# EAGLE design 2023-06-29 LVMi Thermistors (EAGLE 9.6.2)

## Sheet 1 of 4
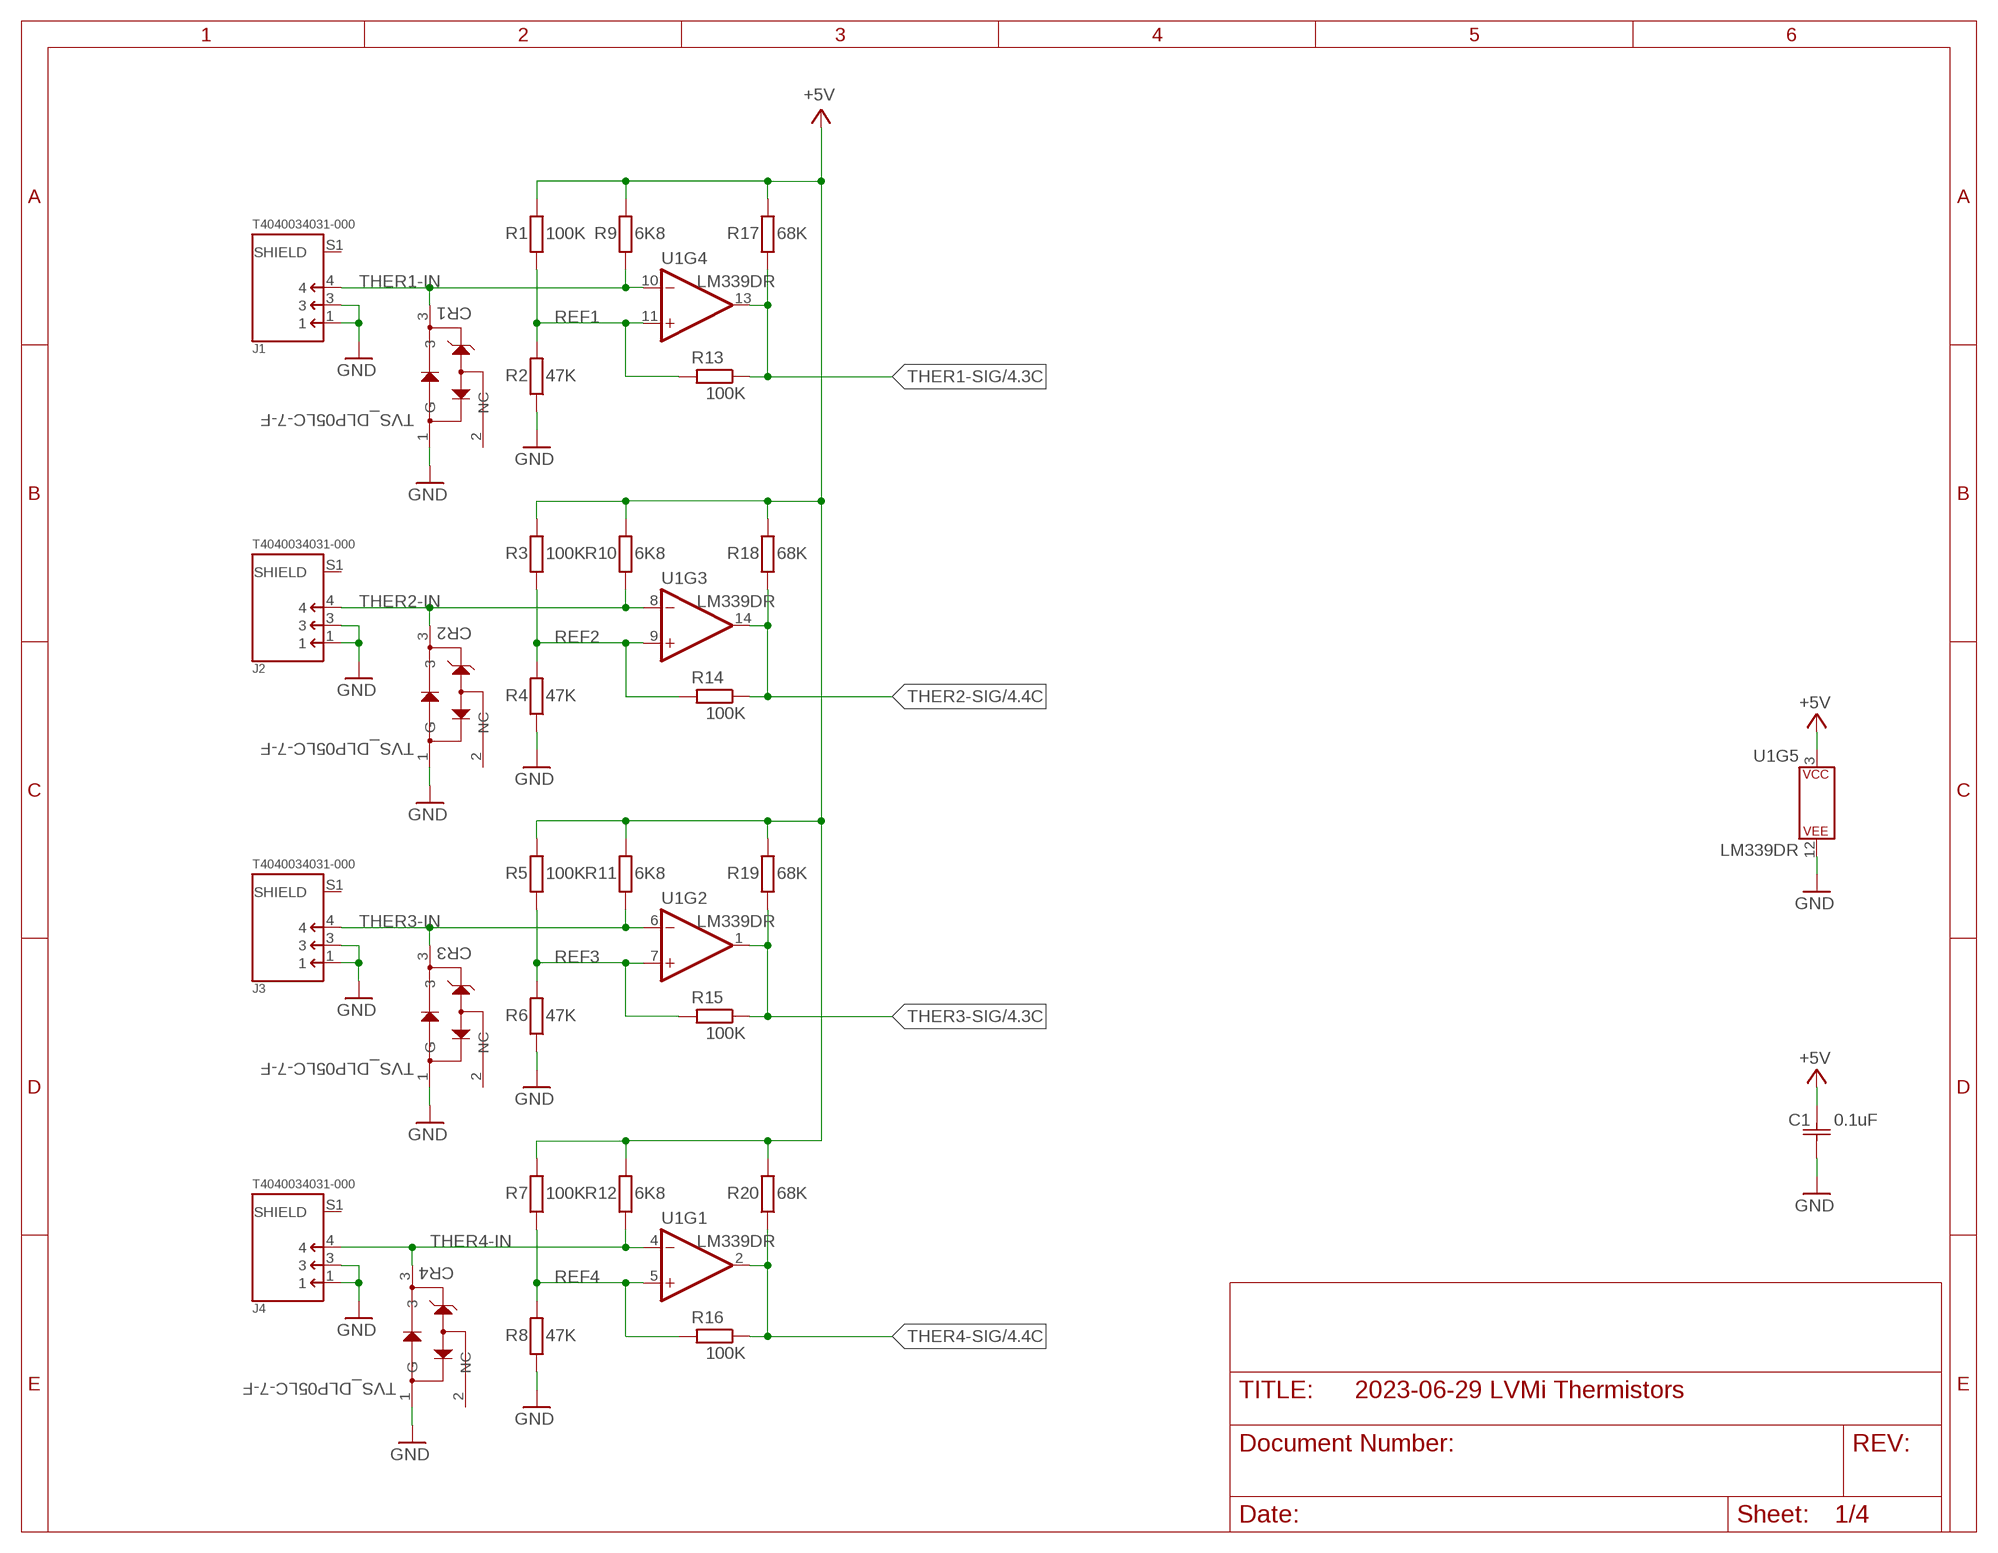
[diagram p0: schematic, sheet 1]

### Parts
C1  0.1uF  CAPTHRUHOLE  [K104K15X7RF5TL2_VIS]
CR1  TVS_DLP05LC-7-F  [SOT23_DLP05LC_DIO]
CR2  TVS_DLP05LC-7-F  [SOT23_DLP05LC_DIO]
CR3  TVS_DLP05LC-7-F  [SOT23_DLP05LC_DIO]
CR4  TVS_DLP05LC-7-F  [SOT23_DLP05LC_DIO]
J1  T4040034031-000  [TE_T4040034031-000]
J2  T4040034031-000  [TE_T4040034031-000]
J3  T4040034031-000  [TE_T4040034031-000]
J4  T4040034031-000  [TE_T4040034031-000]
R1  100K  R-EU_0207/10  [0207/10]
R2  47K  R-EU_0207/10  [0207/10]
R3  100K  R-EU_0207/10  [0207/10]
R4  47K  R-EU_0207/10  [0207/10]
R5  100K  R-EU_0207/10  [0207/10]
R6  47K  R-EU_0207/10  [0207/10]
R7  100K  R-EU_0207/10  [0207/10]
R8  47K  R-EU_0207/10  [0207/10]
R9  6K8  R-EU_0207/10  [0207/10]
R10  6K8  R-EU_0207/10  [0207/10]
R11  6K8  R-EU_0207/10  [0207/10]
R12  6K8  R-EU_0207/10  [0207/10]
R13  100K  R-EU_0207/10  [0207/10]
R14  100K  R-EU_0207/10  [0207/10]
R15  100K  R-EU_0207/10  [0207/10]
R16  100K  R-EU_0207/10  [0207/10]
R17  68K  R-EU_0207/10  [0207/10]
R18  68K  R-EU_0207/10  [0207/10]
R19  68K  R-EU_0207/10  [0207/10]
R20  68K  R-EU_0207/10  [0207/10]
U1  LM339DR  LM339SOIC-14  [SOIC127P599X175-14]

### Nets
+5V: C1.2 R1.2 R3.2 R5.2 R7.2 R9.2 R10.2 R11.2 R12.2 R17.2 R18.2 R19.2 R20.2 U1.3(P$V+) ; also sheet 2,3,4
GND: C1.1 CR1.1(G) CR2.1(G) CR3.1(G) CR4.1(G) J1.1 J1.3 J2.1 J2.3 J3.1 J3.3 J4.1 J4.3 R2.1 R4.1 R6.1 R8.1 U1.12(P$V-) ; also sheet 2,3,4
REF1: R1.1 R2.2 R13.2 U1.11(+IN)
REF2: R3.1 R4.2 R14.2 U1.9(+IN)
REF3: R5.1 R6.2 R15.2 U1.7(+IN)
REF4: R7.1 R8.2 R16.2 U1.5(+IN)
THER1-IN: CR1.3 J1.4 R9.1 U1.10(-IN)
THER1-SIG: R13.1 R17.1 U1.13(OUT) ; also sheet 4
THER2-IN: CR2.3 J2.4 R10.1 U1.8(-IN)
THER2-SIG: R14.1 R18.1 U1.14(OUT) ; also sheet 4
THER3-IN: CR3.3 J3.4 R11.1 U1.6(-IN)
THER3-SIG: R15.1 R19.1 U1.1(OUT) ; also sheet 4
THER4-IN: CR4.3 J4.4 R12.1 U1.4(-IN)
THER4-SIG: R16.1 R20.1 U1.2(OUT) ; also sheet 4
Unconnected: CR1.2(NC) CR2.2(NC) CR3.2(NC) CR4.2(NC) J1.S1(SHIELD) J2.S1(SHIELD) J3.S1(SHIELD) J4.S1(SHIELD)

### Notes on the sheet
- Thermistor Connectors and Comparators

## Sheet 2 of 4
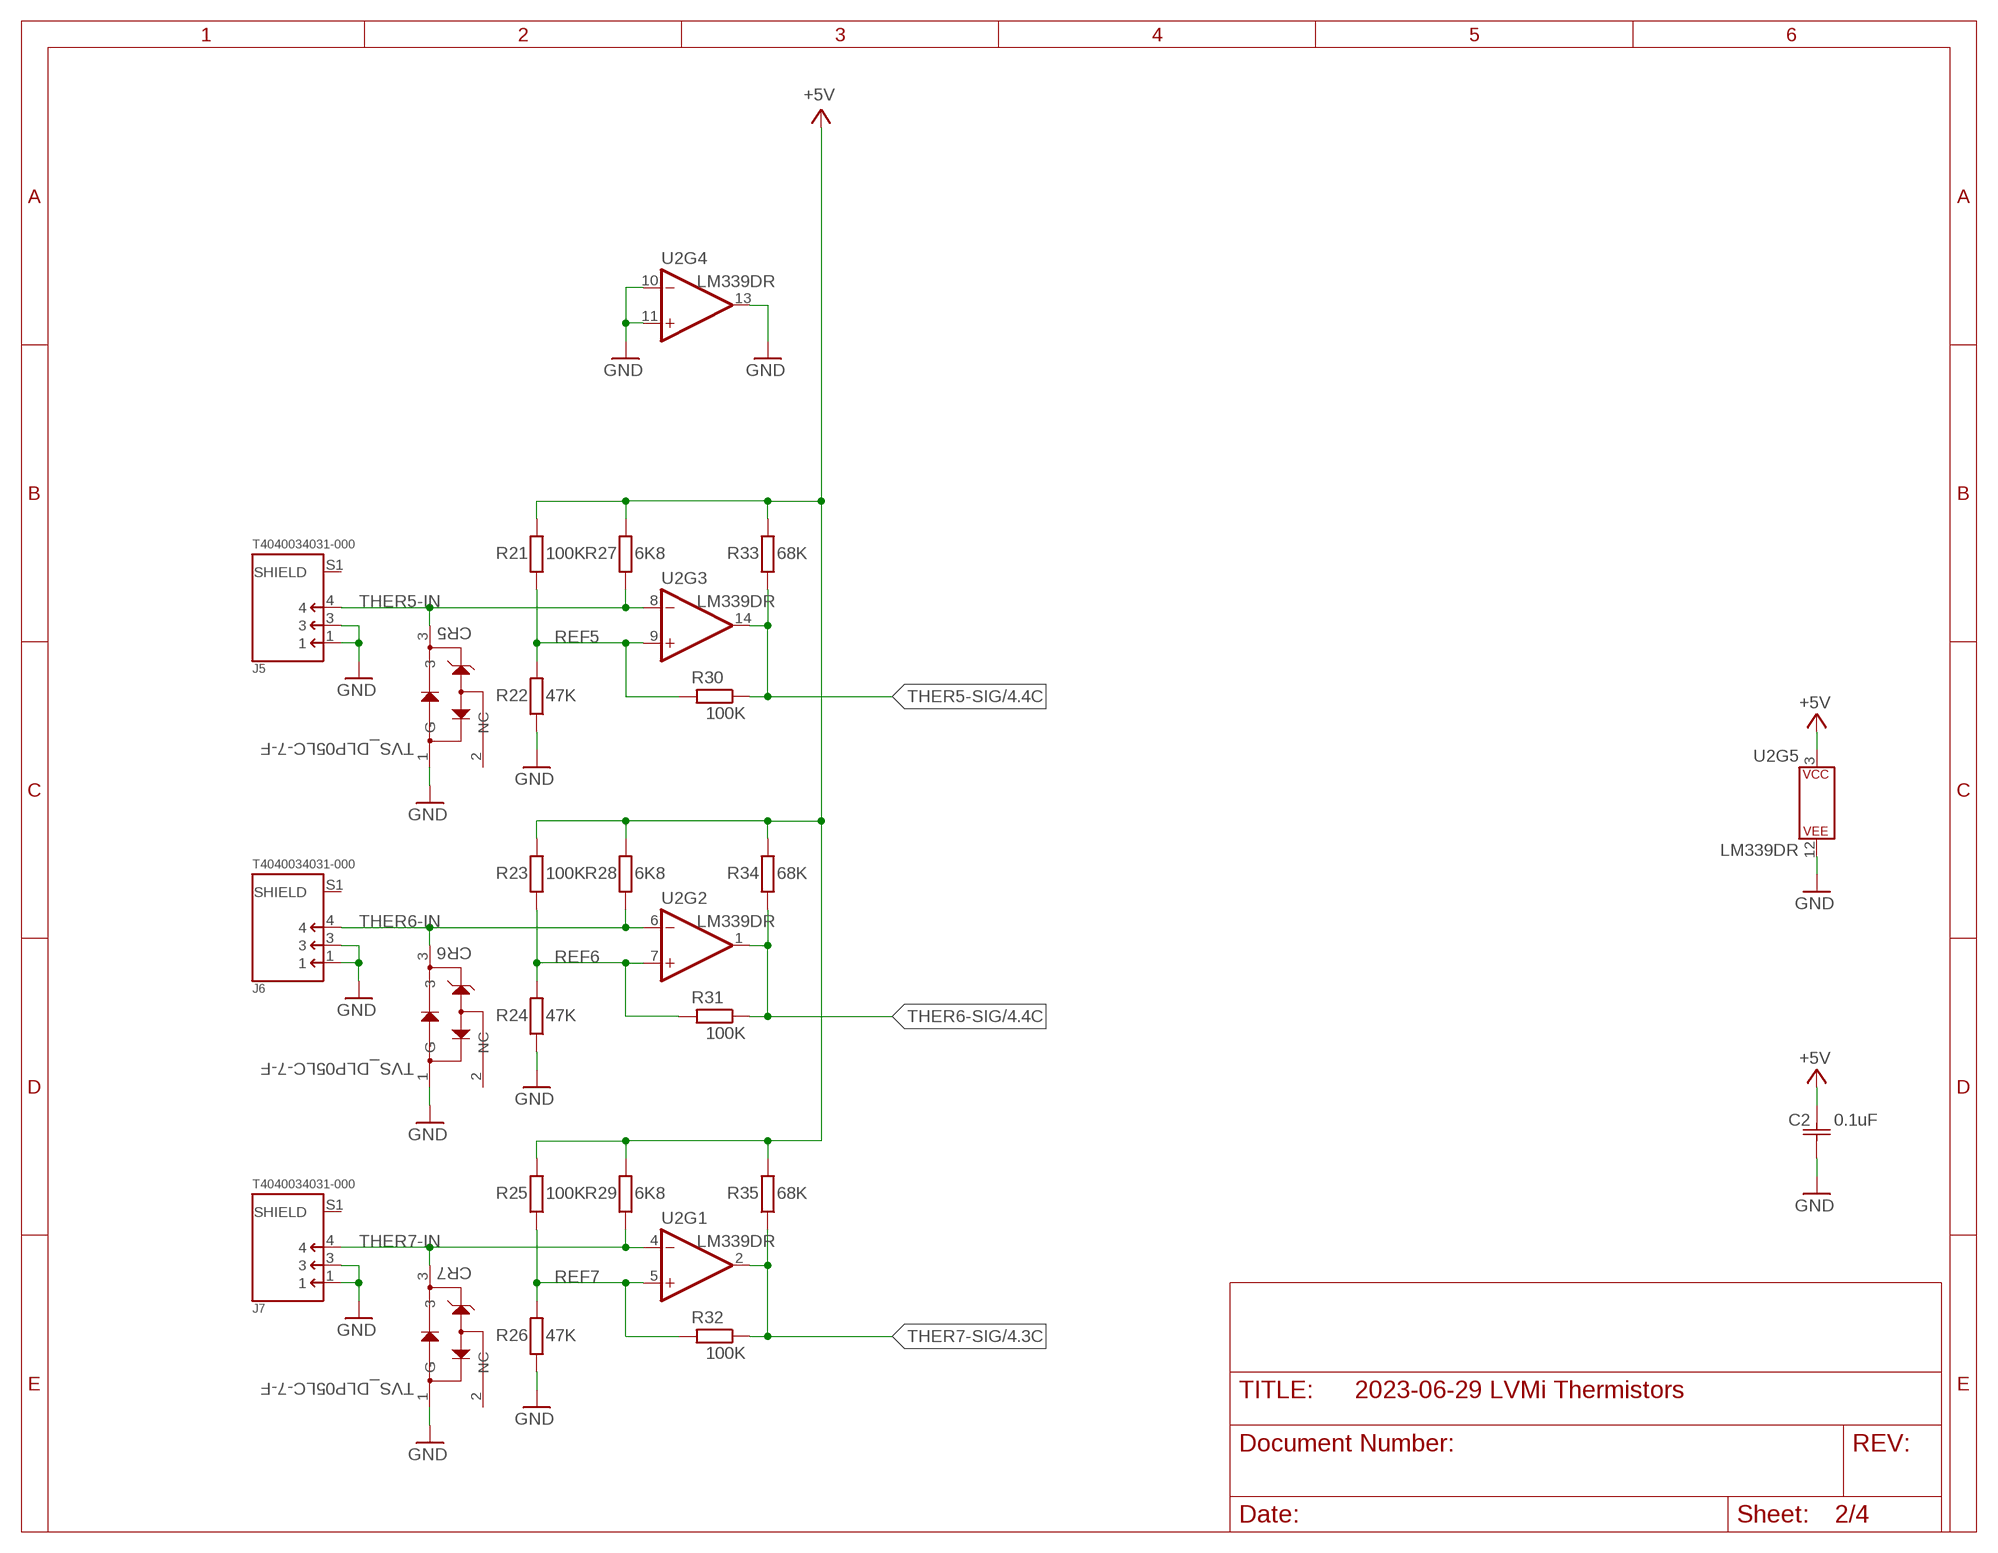
[diagram p1: schematic, sheet 2]

### Parts
C2  0.1uF  CAPTHRUHOLE  [K104K15X7RF5TL2_VIS]
CR5  TVS_DLP05LC-7-F  [SOT23_DLP05LC_DIO]
CR6  TVS_DLP05LC-7-F  [SOT23_DLP05LC_DIO]
CR7  TVS_DLP05LC-7-F  [SOT23_DLP05LC_DIO]
J5  T4040034031-000  [TE_T4040034031-000]
J6  T4040034031-000  [TE_T4040034031-000]
J7  T4040034031-000  [TE_T4040034031-000]
R21  100K  R-EU_0207/10  [0207/10]
R22  47K  R-EU_0207/10  [0207/10]
R23  100K  R-EU_0207/10  [0207/10]
R24  47K  R-EU_0207/10  [0207/10]
R25  100K  R-EU_0207/10  [0207/10]
R26  47K  R-EU_0207/10  [0207/10]
R27  6K8  R-EU_0207/10  [0207/10]
R28  6K8  R-EU_0207/10  [0207/10]
R29  6K8  R-EU_0207/10  [0207/10]
R30  100K  R-EU_0207/10  [0207/10]
R31  100K  R-EU_0207/10  [0207/10]
R32  100K  R-EU_0207/10  [0207/10]
R33  68K  R-EU_0207/10  [0207/10]
R34  68K  R-EU_0207/10  [0207/10]
R35  68K  R-EU_0207/10  [0207/10]
U2  LM339DR  LM339SOIC-14  [SOIC127P599X175-14]

### Nets
+5V: C2.2 R21.2 R23.2 R25.2 R27.2 R28.2 R29.2 R33.2 R34.2 R35.2 U2.3(P$V+) ; also sheet 1,3,4
GND: C2.1 CR5.1(G) CR6.1(G) CR7.1(G) J5.1 J5.3 J6.1 J6.3 J7.1 J7.3 R22.1 R24.1 R26.1 U2.10(-IN) U2.11(+IN) U2.12(P$V-) U2.13(OUT) ; also sheet 1,3,4
REF5: R21.1 R22.2 R30.2 U2.9(+IN)
REF6: R23.1 R24.2 R31.2 U2.7(+IN)
REF7: R25.1 R26.2 R32.2 U2.5(+IN)
THER5-IN: CR5.3 J5.4 R27.1 U2.8(-IN)
THER5-SIG: R30.1 R33.1 U2.14(OUT) ; also sheet 4
THER6-IN: CR6.3 J6.4 R28.1 U2.6(-IN)
THER6-SIG: R31.1 R34.1 U2.1(OUT) ; also sheet 4
THER7-IN: CR7.3 J7.4 R29.1 U2.4(-IN)
THER7-SIG: R32.1 R35.1 U2.2(OUT) ; also sheet 4
Unconnected: CR5.2(NC) CR6.2(NC) CR7.2(NC) J5.S1(SHIELD) J6.S1(SHIELD) J7.S1(SHIELD)

## Sheet 3 of 4
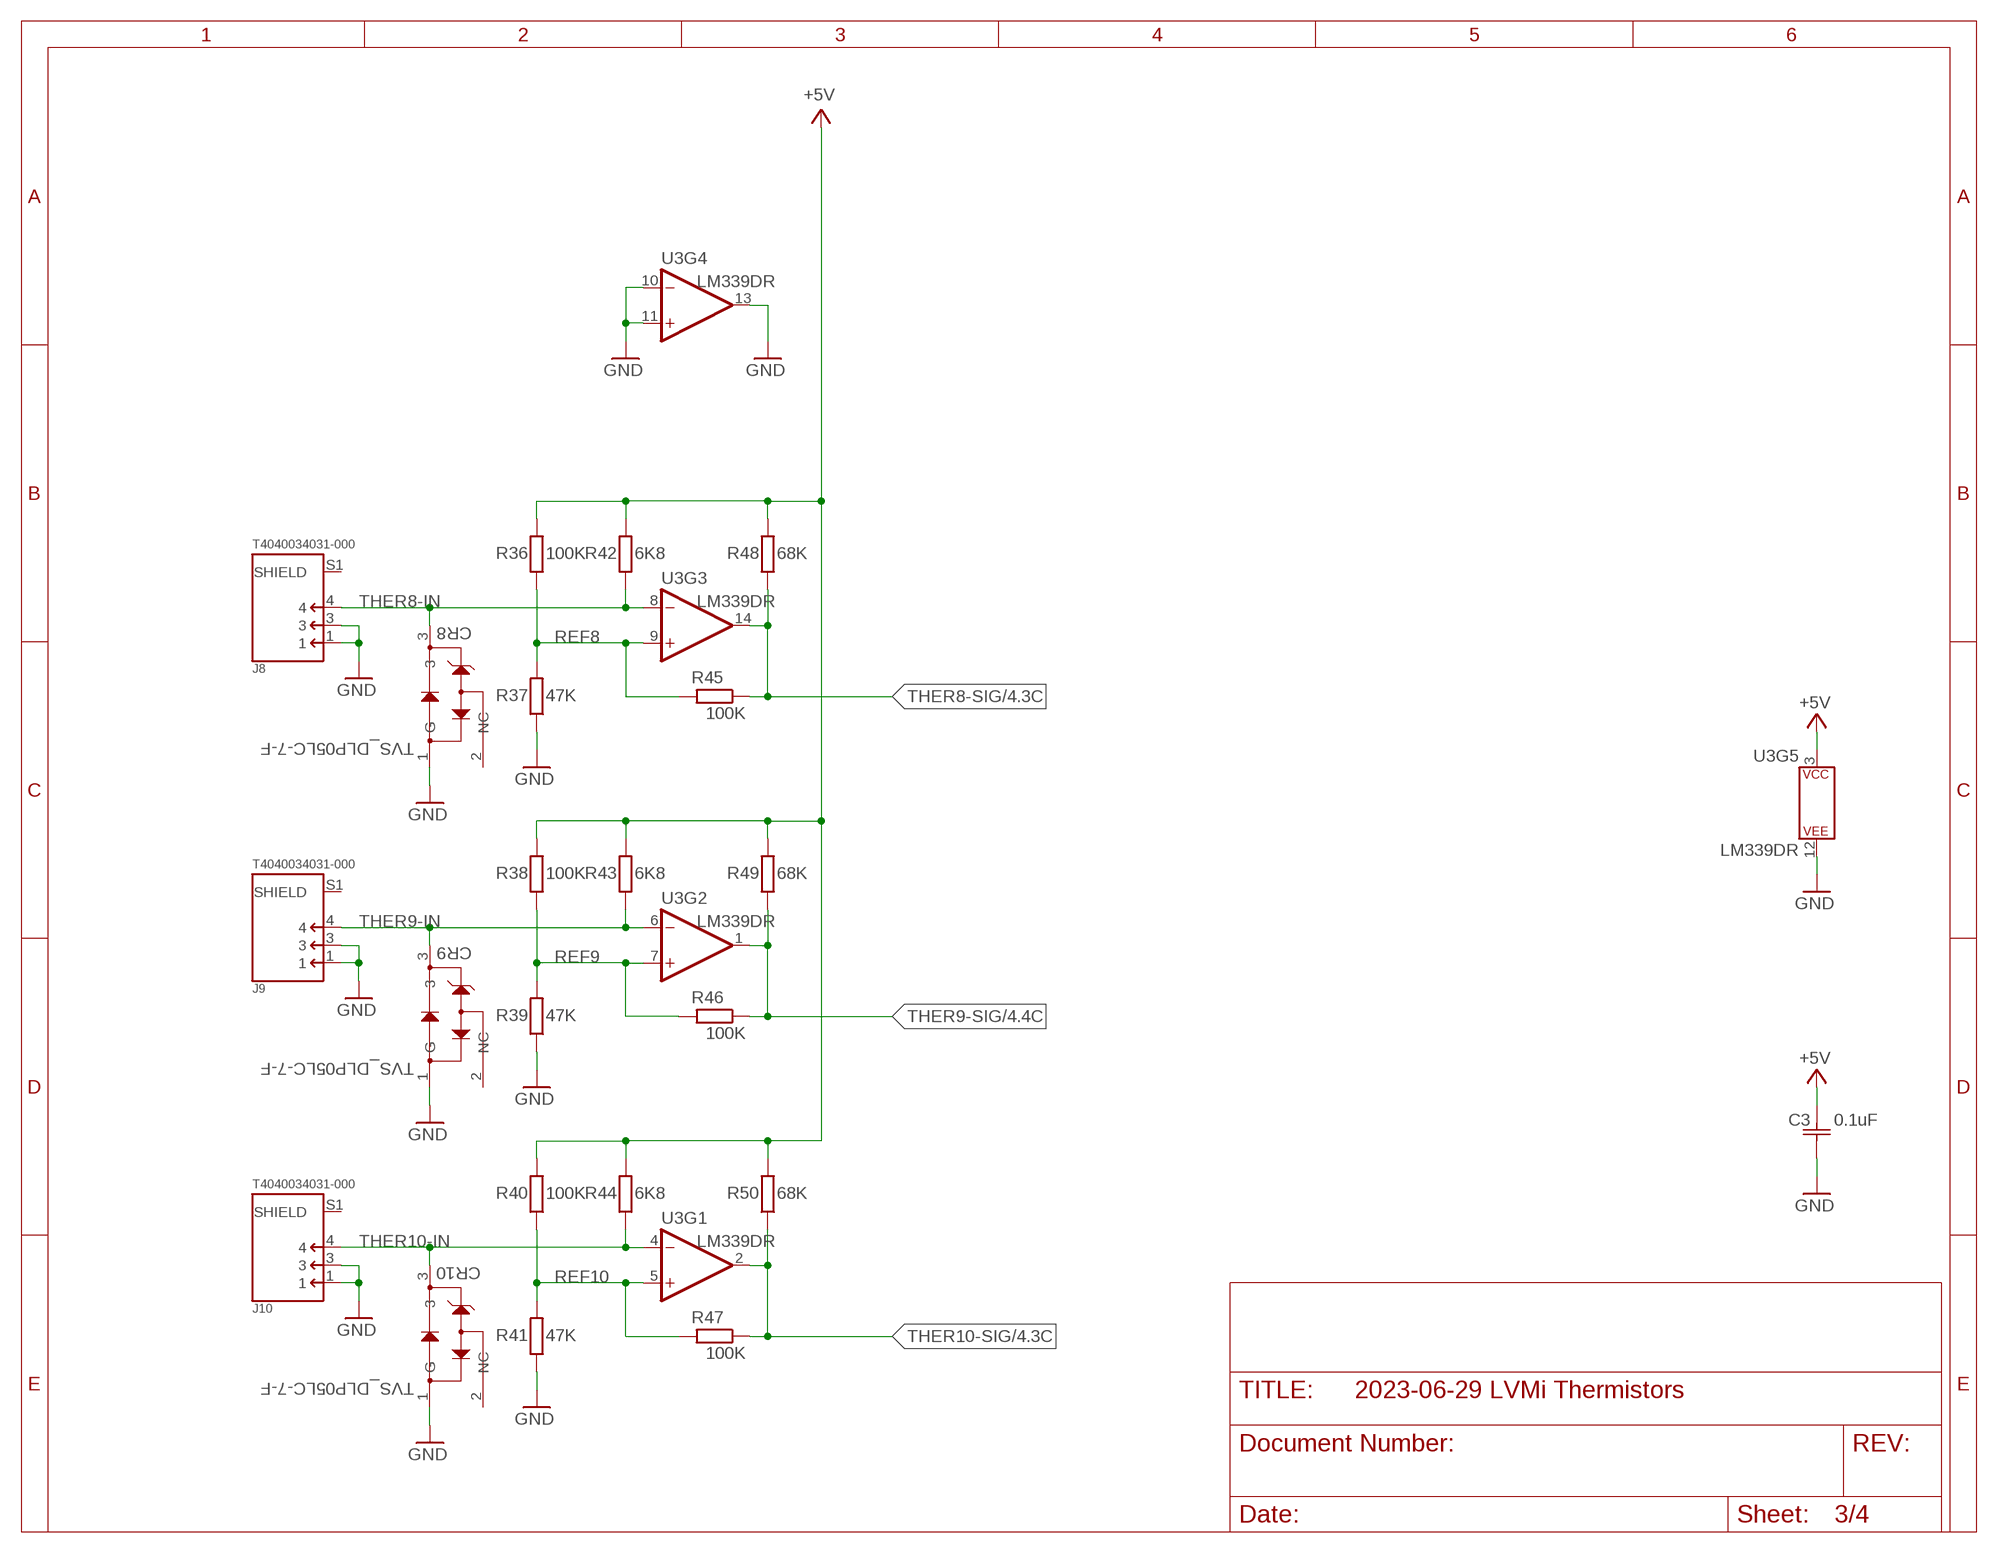
[diagram p2: schematic, sheet 3]

### Parts
C3  0.1uF  CAPTHRUHOLE  [K104K15X7RF5TL2_VIS]
CR8  TVS_DLP05LC-7-F  [SOT23_DLP05LC_DIO]
CR9  TVS_DLP05LC-7-F  [SOT23_DLP05LC_DIO]
CR10  TVS_DLP05LC-7-F  [SOT23_DLP05LC_DIO]
J8  T4040034031-000  [TE_T4040034031-000]
J9  T4040034031-000  [TE_T4040034031-000]
J10  T4040034031-000  [TE_T4040034031-000]
R36  100K  R-EU_0207/10  [0207/10]
R37  47K  R-EU_0207/10  [0207/10]
R38  100K  R-EU_0207/10  [0207/10]
R39  47K  R-EU_0207/10  [0207/10]
R40  100K  R-EU_0207/10  [0207/10]
R41  47K  R-EU_0207/10  [0207/10]
R42  6K8  R-EU_0207/10  [0207/10]
R43  6K8  R-EU_0207/10  [0207/10]
R44  6K8  R-EU_0207/10  [0207/10]
R45  100K  R-EU_0207/10  [0207/10]
R46  100K  R-EU_0207/10  [0207/10]
R47  100K  R-EU_0207/10  [0207/10]
R48  68K  R-EU_0207/10  [0207/10]
R49  68K  R-EU_0207/10  [0207/10]
R50  68K  R-EU_0207/10  [0207/10]
U3  LM339DR  LM339SOIC-14  [SOIC127P599X175-14]

### Nets
+5V: C3.2 R36.2 R38.2 R40.2 R42.2 R43.2 R44.2 R48.2 R49.2 R50.2 U3.3(P$V+) ; also sheet 1,2,4
GND: C3.1 CR8.1(G) CR9.1(G) CR10.1(G) J8.1 J8.3 J9.1 J9.3 J10.1 J10.3 R37.1 R39.1 R41.1 U3.10(-IN) U3.11(+IN) U3.12(P$V-) U3.13(OUT) ; also sheet 1,2,4
REF8: R36.1 R37.2 R45.2 U3.9(+IN)
REF9: R38.1 R39.2 R46.2 U3.7(+IN)
REF10: R40.1 R41.2 R47.2 U3.5(+IN)
THER8-IN: CR8.3 J8.4 R42.1 U3.8(-IN)
THER8-SIG: R45.1 R48.1 U3.14(OUT) ; also sheet 4
THER9-IN: CR9.3 J9.4 R43.1 U3.6(-IN)
THER9-SIG: R46.1 R49.1 U3.1(OUT) ; also sheet 4
THER10-IN: CR10.3 J10.4 R44.1 U3.4(-IN)
THER10-SIG: R47.1 R50.1 U3.2(OUT) ; also sheet 4
Unconnected: CR8.2(NC) CR9.2(NC) CR10.2(NC) J8.S1(SHIELD) J9.S1(SHIELD) J10.S1(SHIELD)

## Sheet 4 of 4
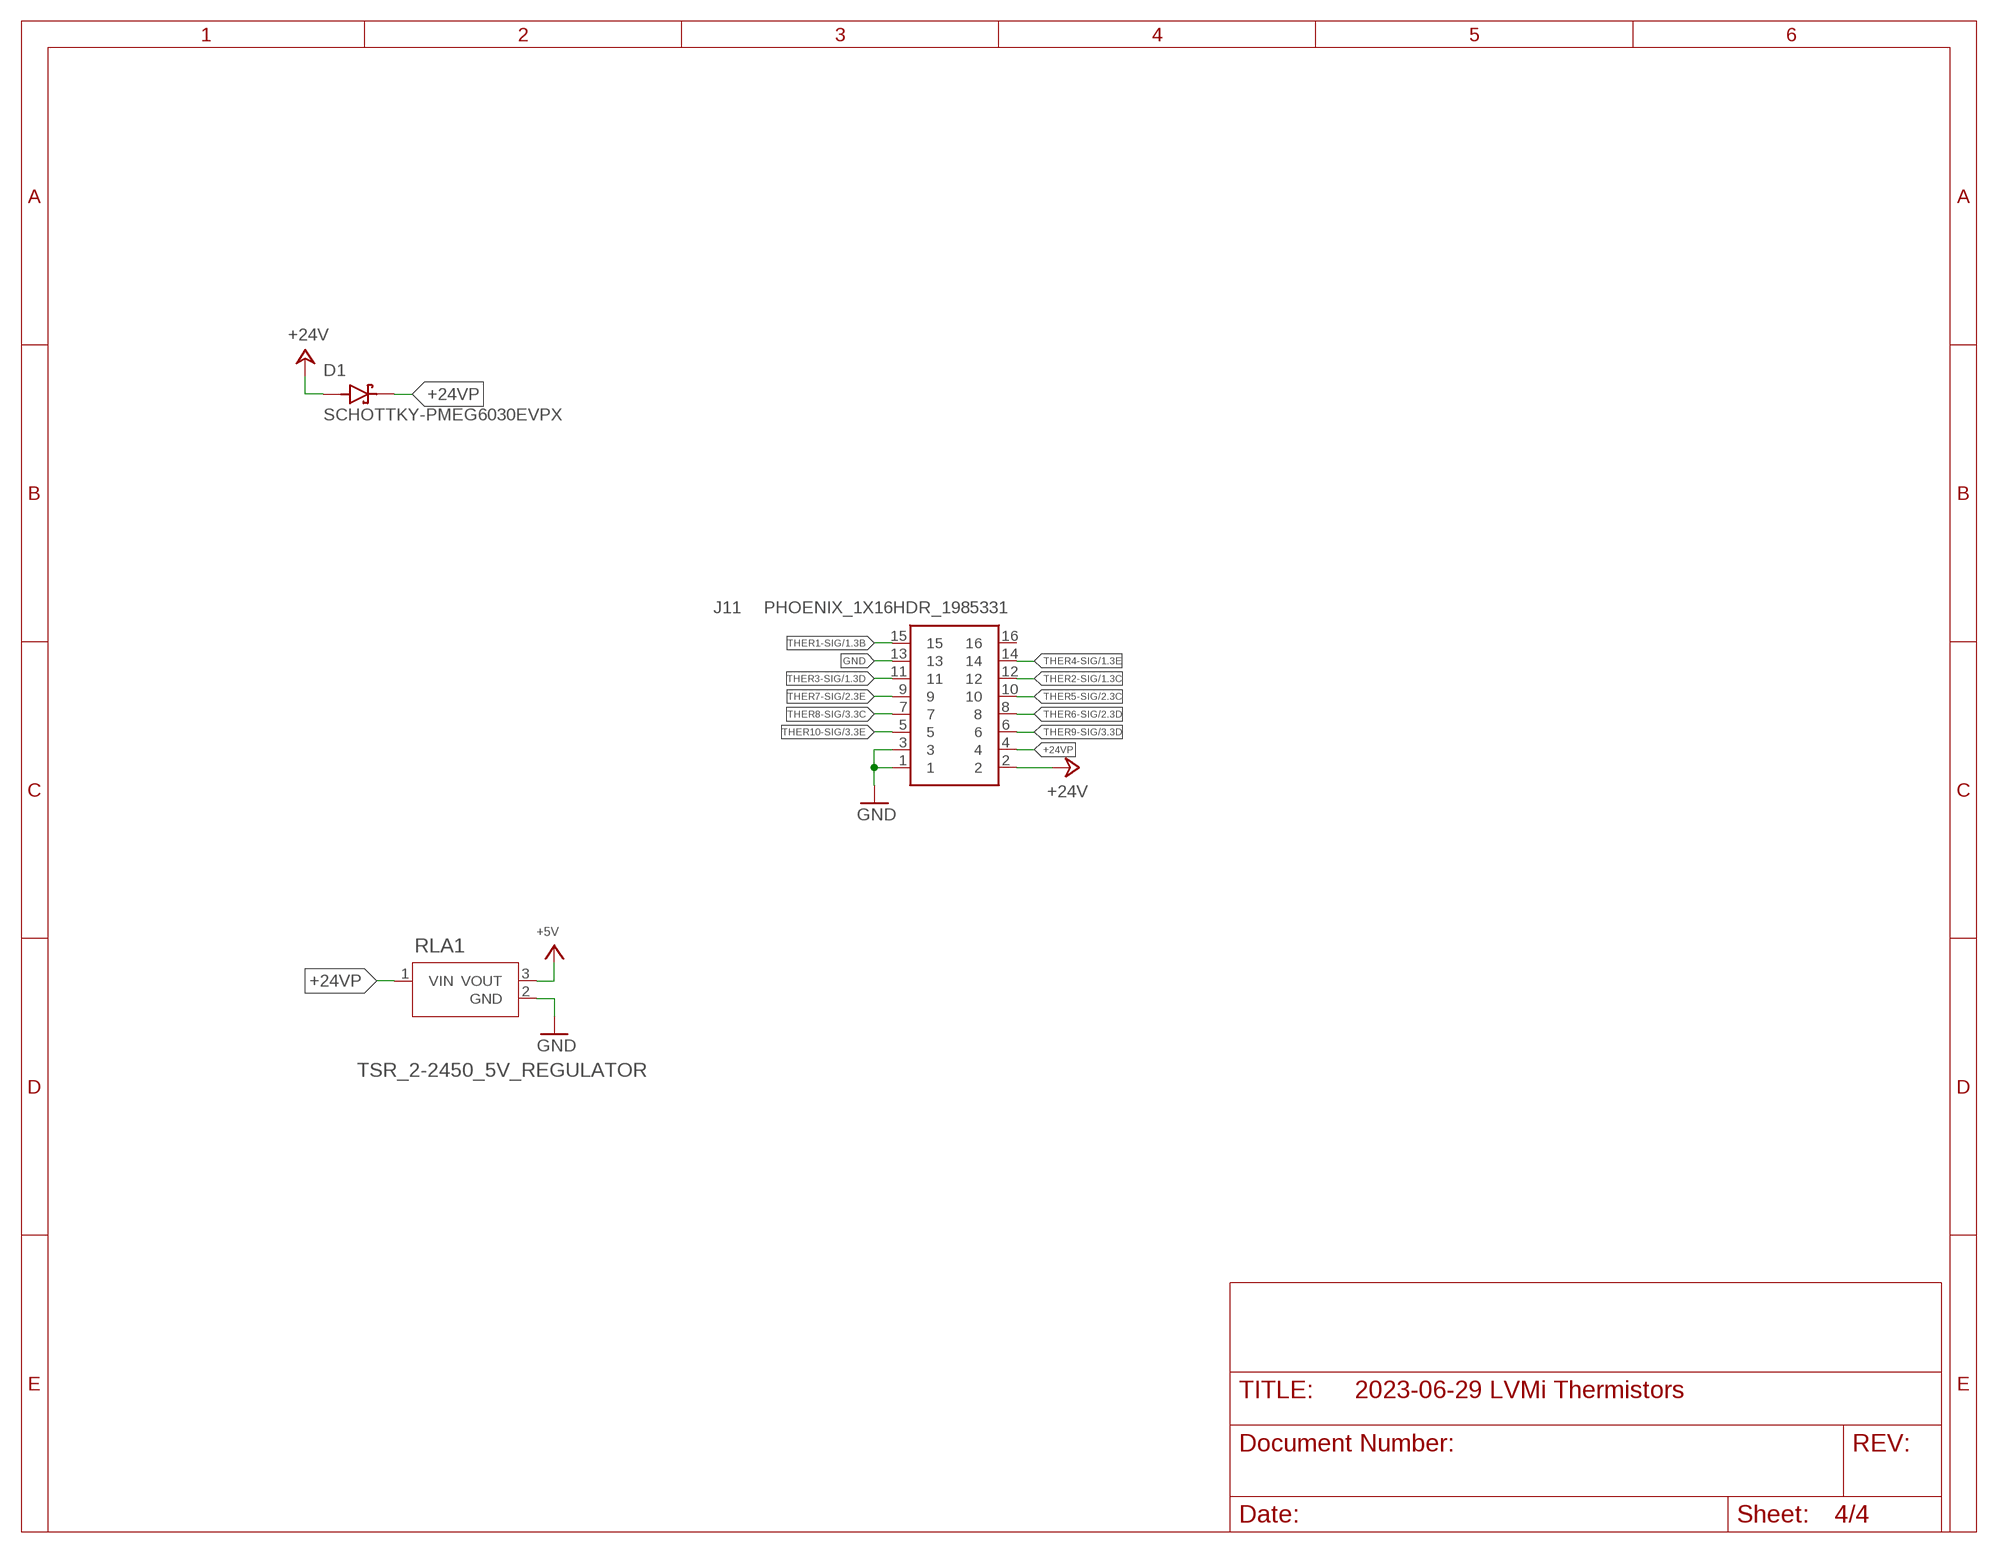
[diagram p3: schematic, sheet 4]

### Parts
D1  SCHOTTKY-PMEG6030EVPX  [DIO_PMEG6030EVPX]
J11  PHOENIX_1X16HDR_1985331  [1985331]
RLA1  TSR_2-2450_5V_REGULATOR  [TSR2-SINGLE_TRP]

### Nets
+5V: RLA1.3(VOUT) ; also sheet 1,2,3
+24V: D1.2(A) J11.2
+24VP: D1.1(K) J11.4 RLA1.1(VIN)
GND: J11.1 J11.3 J11.13 RLA1.2(GND) ; also sheet 1,2,3
THER1-SIG: J11.15 ; also sheet 1
THER2-SIG: J11.12 ; also sheet 1
THER3-SIG: J11.11 ; also sheet 1
THER4-SIG: J11.14 ; also sheet 1
THER5-SIG: J11.10 ; also sheet 2
THER6-SIG: J11.8 ; also sheet 2
THER7-SIG: J11.9 ; also sheet 2
THER8-SIG: J11.7 ; also sheet 3
THER9-SIG: J11.6 ; also sheet 3
THER10-SIG: J11.5 ; also sheet 3
Unconnected: J11.16

## Library data of the parts
C1-C3 = AUmlib:CAPTHRUHOLE; COPYRIGHT: Copyright (C) 2023 Ultra Librarian. All rights reserved.; MANUFACTURER_PART_NUMBER: K104K15X7RF5TL2; MFR_NAME: Vishay; TYPE: Ceramic Capacitor
CR1-CR10 = AUmlib:TVS_DLP05LC-7-F; COPYRIGHT: Copyright (C) 2023 Ultra Librarian. All rights reserved.; MANUFACTURER_PART_NUMBER: DLP05LC-7-F; MFR_NAME: Diodes Inc
D1 = AUmlib:SCHOTTKY-PMEG6030EVPX: PMEG6030 Series 60 V 3 A Surface Mount Schottky Barrier Rectifier - SOD-128; DESCRIPTION: Diode Schottky 60V 3A Surface Mount SOD-128/CFP5; DIGI-KEY_PART_NUMBER: 1727-1349-1-ND; MF: Nexperia USA; MP: PMEG6030EVPX; PACKAGE: CFP5-2 Nexperia USA Inc.; PURCHASE-URL: https://pricing.snapeda.com/search/part/PMEG6030EVPX/?ref=eda
J1-J10 = AUmlib:T4040034031-000: Male Receptacle Connector M8.FMLE.PNLREAR.3POS.STR PCBSHLD 3 POS; MANUFACTURER: TE; MAXIMUM_PACKAGE_HEIGHT: 15.7mm; PARTREV: Rev A; STANDARD: Manufacturer Recommendations
J11 = AUmlib:PHOENIX_1X16HDR_1985331: PTSA 1,5/16-3,5-Z Source: Datasheet <https://datasheet.datasheetarchive.com/originals/distributors/SFDatasheet-2/sf-00059086.pdf>; DESCRIPTION: PTSA 1,5/16-3,5-Z; HEIGHT: 13.1mm; MANUFACTURER_NAME: Phoenix Contact; MANUFACTURER_PART_NUMBER: 1985331; MOUSER_PART_NUMBER: 651-1985331; MOUSER_PRICE-STOCK: https://www.mouser.co.uk/ProductDetail/Phoenix-Contact/1985331?qs=uD%2FdkN7XIa2gzzUd7QLZ1Q%3D%3D
R1-R50 = AUmlib:R-EU_: RESISTOR, European symbol; SPICEPREFIX: R
RLA1 = AUmlib:TSR_2-2450_5V_REGULATOR; COPYRIGHT: Copyright (C) 2022 Ultra Librarian. All rights reserved.; DIGI-KEY_PART_NUMBER_1: 1951-2692-ND; MANUFACTURER_PART_NUMBER: TSR 2-2450; MFR_NAME: Traco Power
U1-U3 = AUmlib:LM339: Quad Comparator - LM339PWR Based on information from the SLCS006N datasheet from TI (www.ti.com). Created by nick@scantool.net, 2008. Updated 2016. SparkFun Products SparkFun OBD-II UART <https://www.sparkfun.com/products/9555> (WIG-09555) SparkFun Car Diagnostics Kit <https://www.sparkfun.com/products/10769> (RTL-10769)

## Board
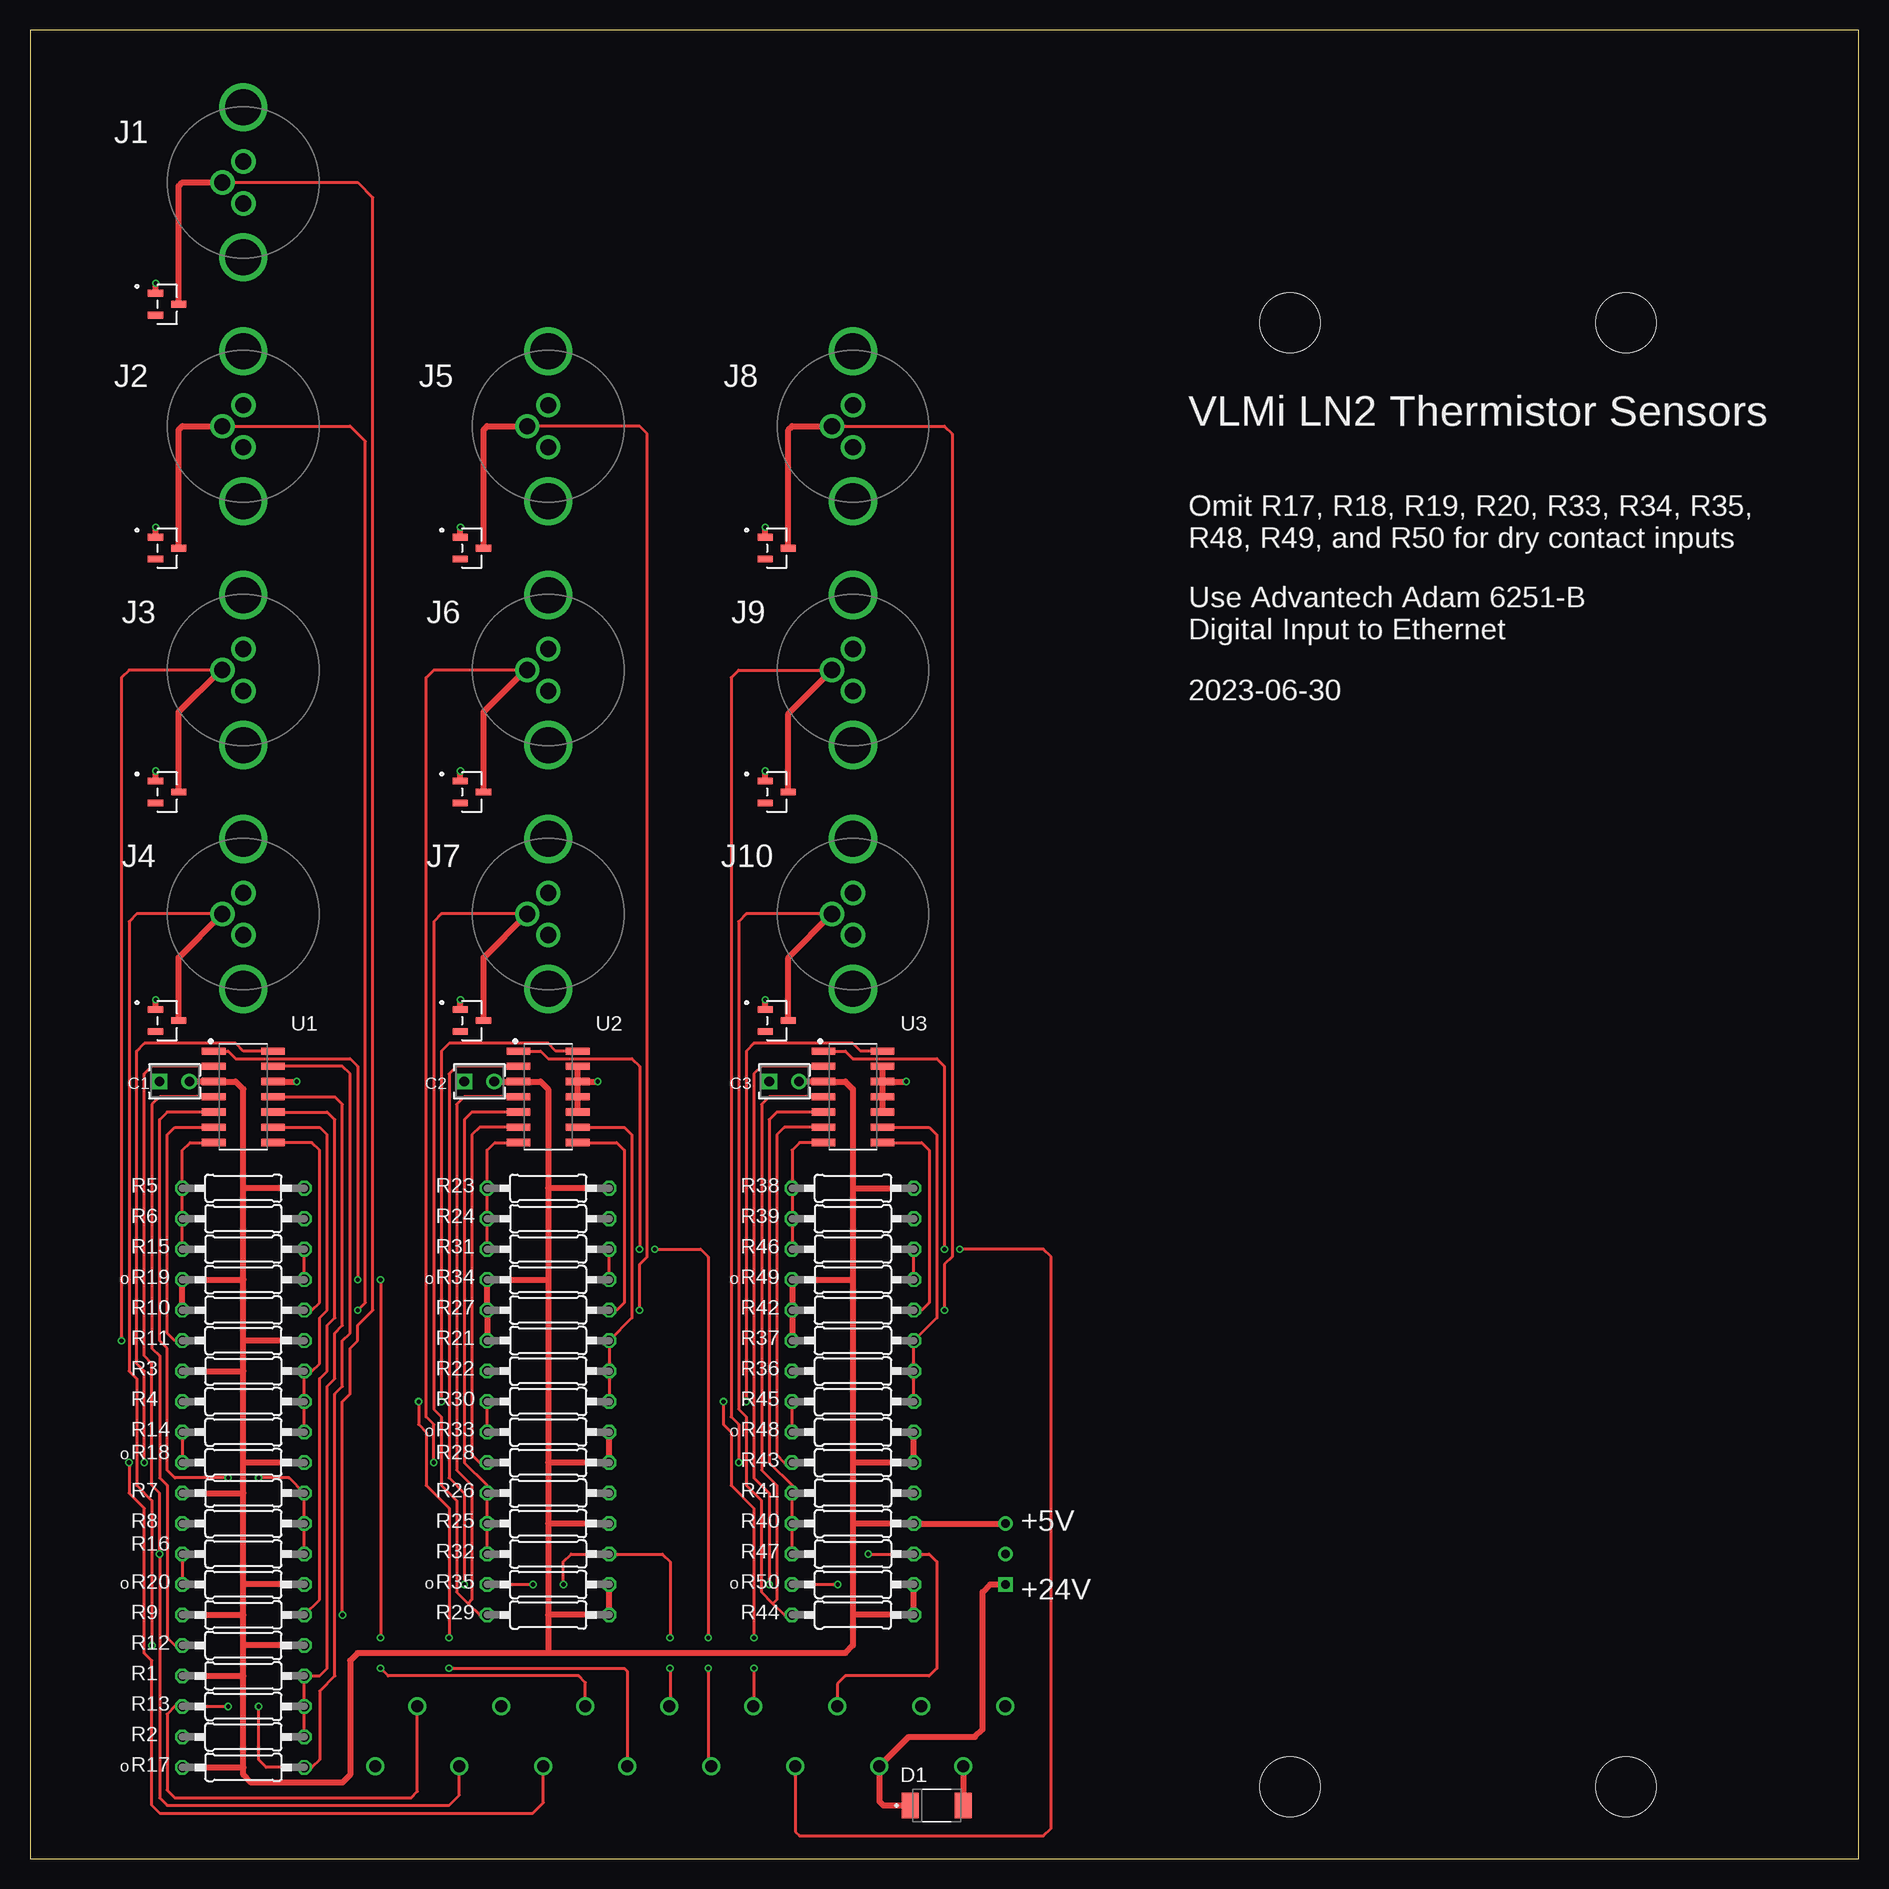
[diagram p4: board, top side]
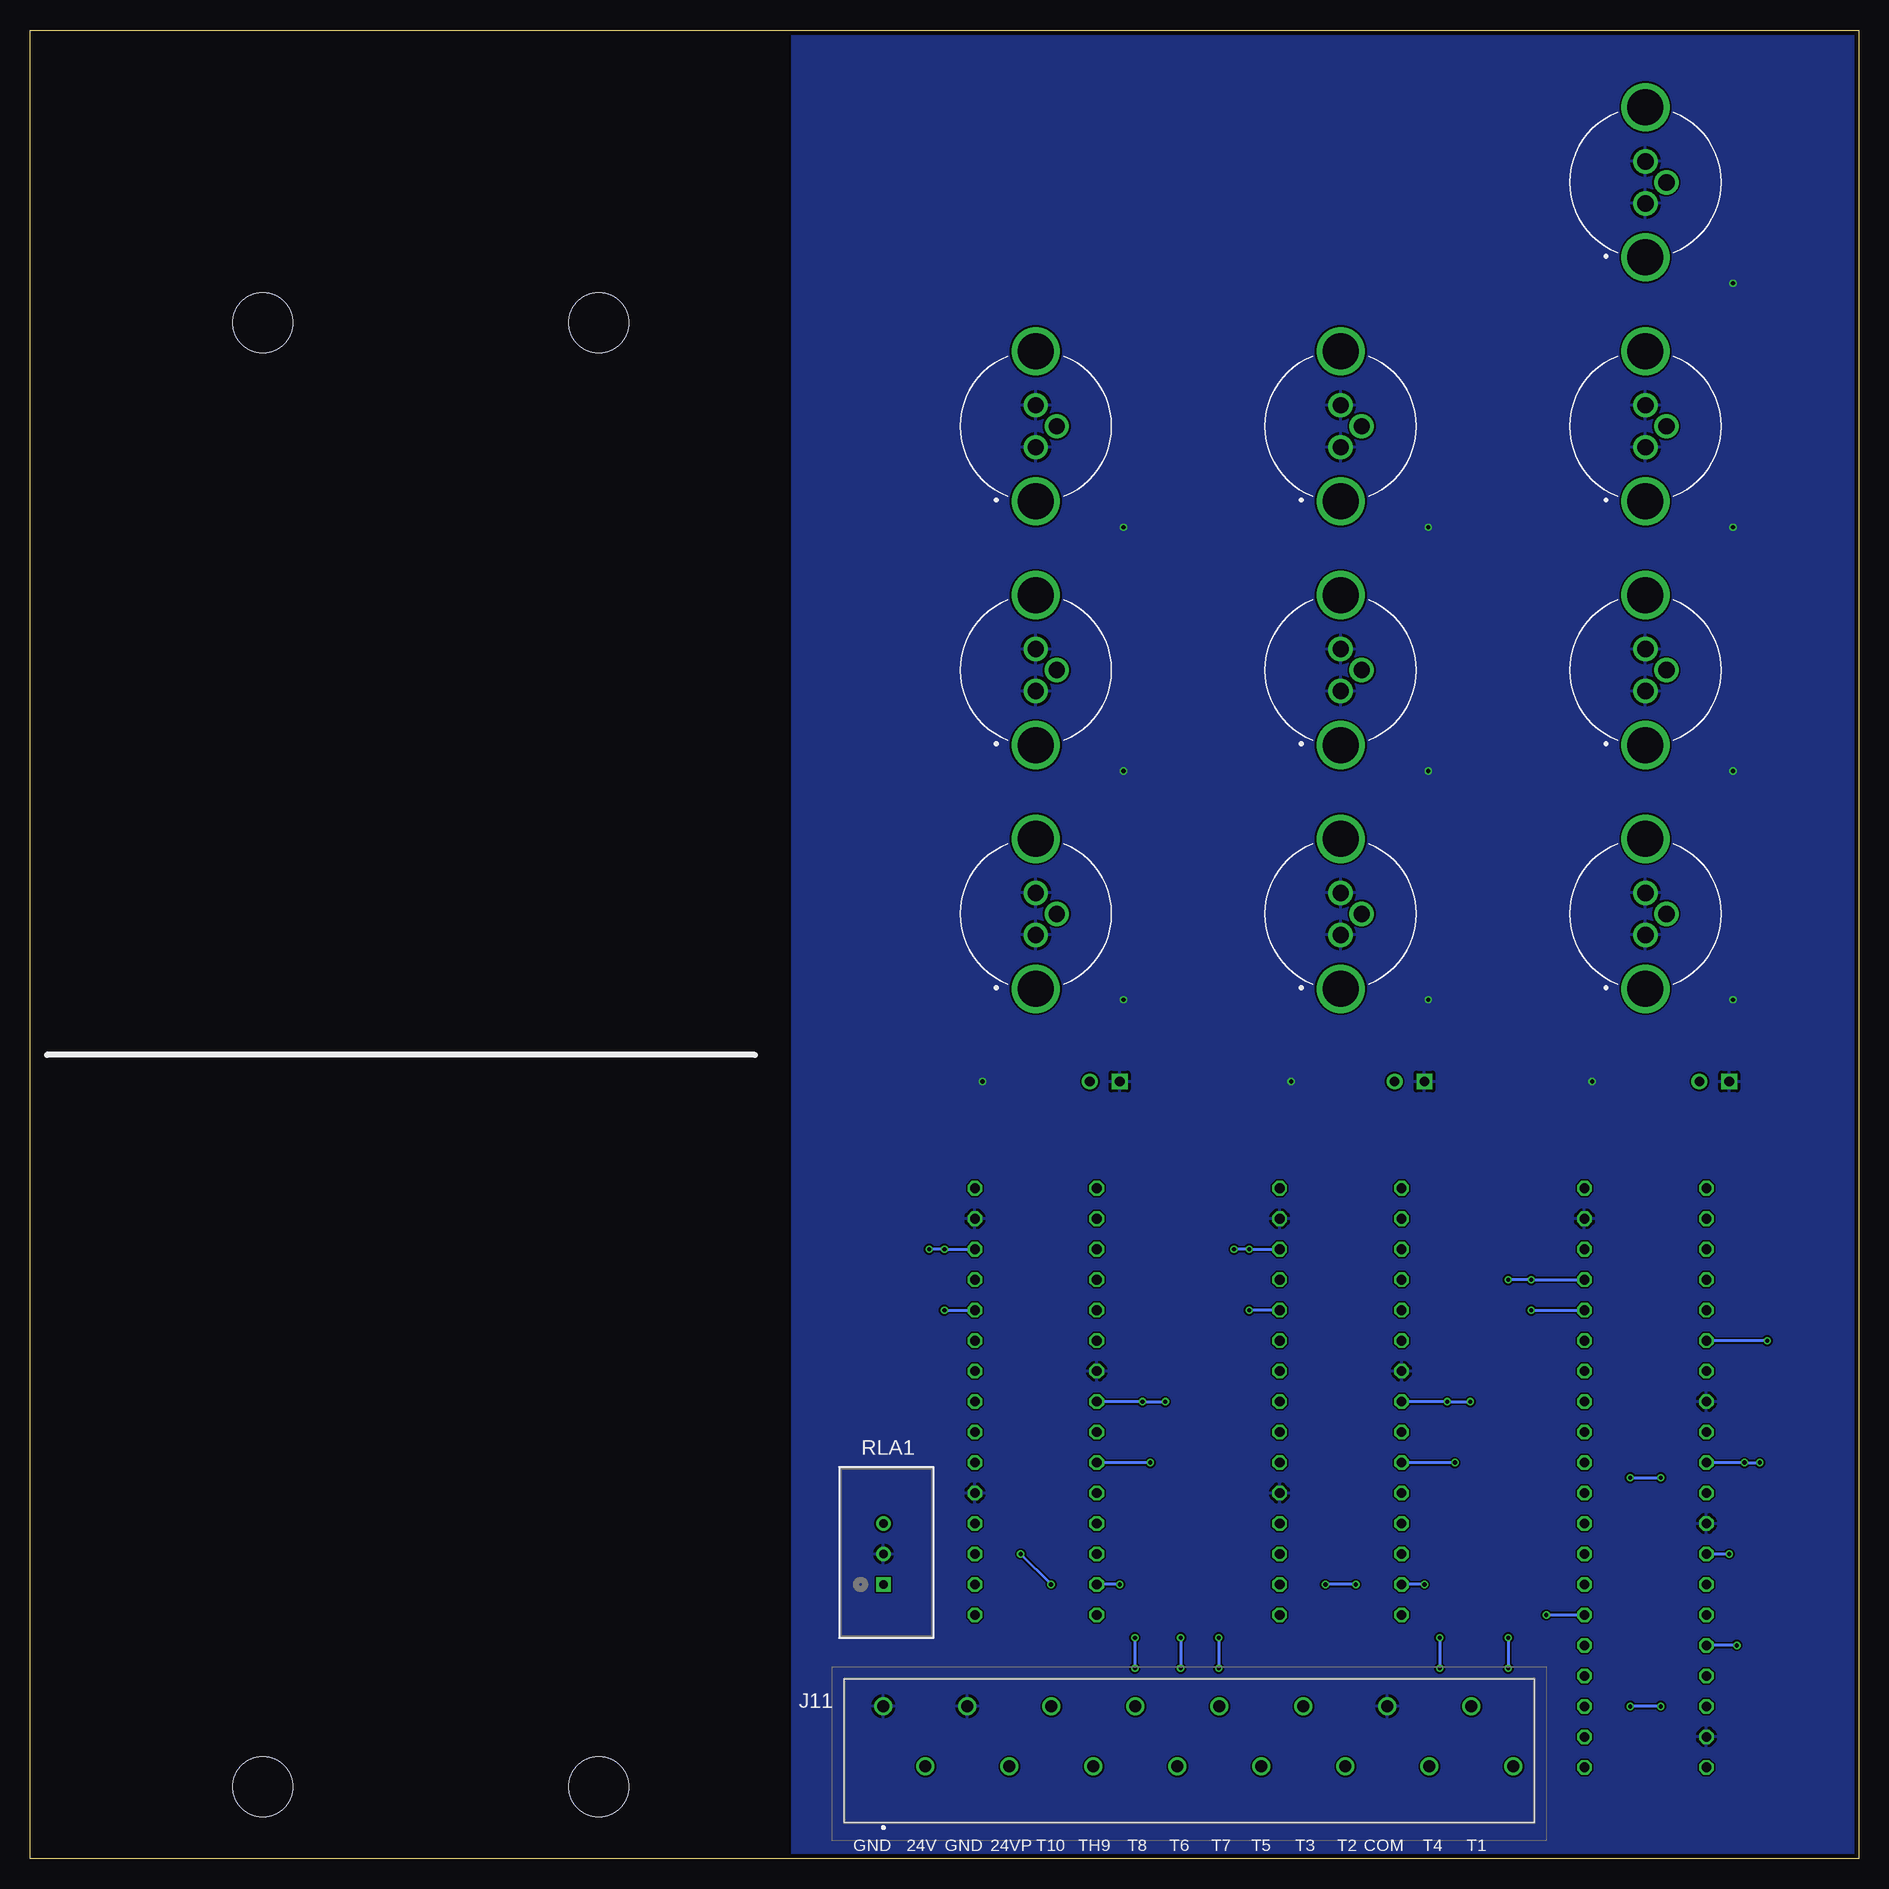
[diagram p5: board, bottom side, seen from below]

Size 152.4 x 152.4 mm. Coordinates in mm from the lower left corner, seen from the top.
Outline: 0,0 152.4,0 152.4,152.4 0,152.4 0,0
Copper layers (1*16): Top 0.035559375mm / dielectric 1.6mm / Bottom 0.035559375mm
Design rules "oshpark-2layer": minimum track width 6mil, minimum drill 10mil, track to track 6mil, track to pad 6mil, pad to pad 6mil, via to via 6mil, smd to smd 6mil, copper to edge 15mil, drill to drill 6mil, minimum pad ring 5mil, minimum via ring 5mil, stop-mask expansion 2.5mil, vias tented up to drill 0mil, thermal gap 10mil
Holes 5 mm at 105,6 133,6 105,128 133,128

### Footprints (pad centres in the part's own frame; a part is rotated, then mirrored left to right if it is on the bottom)
K104K15X7RF5TL2_VIS = drill 0.813 pad 1.321 square: 1 0,0 | drill 0.813 pad 1.321: 2 2.489,0
SOT23_DLP05LC_DIO = smd 0.559 x 1.27: 1 -0.915,-0.965; 2 0.915,-0.965; 3 0,0.965
DIO_PMEG6030EVPX = smd 1.4 x 2.1: 1 -2.2,0; 2 2.2,0
TE_T4040034031-000 = drill 1.35 pad 1.85: 1 -1.75,0; 3 1.75,0; 4 0,1.75 | drill 3: S1 6.25,0; S2 -6.25,0
1985331 = drill 1 pad 1.5: 1 0,0; 2 3.5,-5; 3 7,0; 4 10.5,-5; 5 14,0; 6 17.5,-5; 7 21,0; 8 24.5,-5; 9 28,0; 10 31.5,-5; 11 35,0; 12 38.5,-5; 13 42,0; 14 45.5,-5; 15 49,0; 16 52.5,-5
0207/10 = drill 0.813 octagon: 1 -5.08,0; 2 5.08,0
TSR2-SINGLE_TRP = drill 0.711 pad 1.219 square: 1 0,0 | drill 0.711 pad 1.219: 2 2.54,0; 3 5.08,0
SOIC127P599X175-14 = smd 1.967 x 0.594: 1 -2.469,3.81; 2 -2.469,2.54; 3 -2.469,1.27; 4 -2.469,0; 5 -2.469,-1.27; 6 -2.469,-2.54; 7 -2.469,-3.81; 8 2.469,-3.81; 9 2.469,-2.54; 10 2.469,-1.27; 11 2.469,0; 12 2.469,1.27; 13 2.469,2.54; 14 2.469,3.81

### Placement (x,y rotation side)
C1  10.79,64.77 0 top
C2  36.2,64.77 0 top
C3  61.59,64.77 0 top
CR1  11.43,129.54 270 top
CR2  11.43,109.22 270 top
CR3  11.43,88.9 270 top
CR4  11.43,69.85 270 top
CR5  36.83,109.22 270 top
CR6  36.83,88.9 270 top
CR7  36.83,69.85 270 top
CR8  62.23,109.22 270 top
CR9  62.23,88.9 270 top
CR10  62.23,69.85 270 top
D1  75.56,4.45 0 top
J1  17.78,139.7 90 top
J2  17.78,119.38 90 top
J3  17.78,99.06 90 top
J4  17.78,78.74 90 top
J5  43.18,119.38 90 top
J6  43.18,99.06 90 top
J7  43.18,78.74 90 top
J8  68.58,119.38 90 top
J9  68.58,99.06 90 top
J10  68.58,78.74 90 top
J11  81.28,12.7 0 bottom
R1  17.78,15.24 180 top
R2  17.78,10.16 0 top
R3  17.78,40.64 180 top
R4  17.78,38.1 0 top
R5  17.78,55.88 0 top
R6  17.78,53.34 180 top
R7  17.78,30.48 180 top
R8  17.78,27.94 0 top
R9  17.78,20.32 180 top
R10  17.78,45.72 180 top
R11  17.78,43.18 0 top
R12  17.78,17.78 0 top
R13  17.78,12.7 0 top
R14  17.78,35.56 0 top
R15  17.78,50.8 180 top
R16  17.78,25.4 0 top
R17  17.78,7.62 180 top
R18  17.78,33.02 0 top
R19  17.78,48.26 180 top
R20  17.78,22.86 0 top
R21  43.18,43.18 180 top
R22  43.18,40.64 0 top
R23  43.18,55.88 0 top
R24  43.18,53.34 180 top
R25  43.18,27.94 0 top
R26  43.18,30.48 180 top
R27  43.18,45.72 180 top
R28  43.18,33.02 0 top
R29  43.18,20.32 0 top
R30  43.18,38.1 0 top
R31  43.18,50.8 180 top
R32  43.18,25.4 180 top
R33  43.18,35.56 0 top
R34  43.18,48.26 180 top
R35  43.18,22.86 0 top
R36  68.58,43.18 180 top
R37  68.58,40.64 0 top
R38  68.58,55.88 0 top
R39  68.58,53.34 180 top
R40  68.58,27.94 0 top
R41  68.58,30.48 180 top
R42  68.58,45.72 180 top
R43  68.58,33.02 0 top
R44  68.58,20.32 0 top
R45  68.58,38.1 0 top
R46  68.58,50.8 180 top
R47  68.58,25.4 180 top
R48  68.58,35.56 0 top
R49  68.58,48.26 180 top
R50  68.58,22.86 0 top
RLA1  81.28,22.86 90 bottom
U1  17.78,63.5 0 top
U2  43.18,63.5 0 top
U3  68.58,63.5 0 top

### Tracks (layer width: path | path; a pad name or v marks a point on that pad's centre or on a via)
+5V
  Top 0.508: C3.2 U3.3 67.94,64.77 68.58,64.14 68.58,55.88 | 68.58,55.88 68.58,48.26 | 68.58,48.26 68.58,33.02 | 68.58,33.02 68.58,27.94 | 68.58,27.94 68.58,20.32 | 68.58,20.32 R44.2 R50.2 | 68.58,27.94 R40.2 RLA1.3 | 68.58,33.02 R43.2 R48.2 | 68.58,48.26 R49.2 R42.2 R36.2 | 68.58,55.88 R38.2 | 43.18,55.88 43.18,64.14 42.55,64.77 U2.3 C2.2 | 43.18,55.88 43.18,48.26 | 43.18,48.26 43.18,33.02 | 43.18,33.02 43.18,27.94 | 43.18,27.94 43.18,20.32 | 43.18,20.32 R29.2 R35.2 | R21.2 R27.2 R34.2 43.18,48.26 | R25.2 43.18,27.94 | 43.18,33.02 R28.2 R33.2 | R23.2 43.18,55.88 | 68.58,20.32 68.58,17.78 67.94,17.14 43.18,17.14 | 43.18,17.14 27.3,17.14 26.67,16.51 26.67,6.99 26.04,6.35 18.41,6.35 17.78,6.99 17.78,7.62 | 43.18,20.32 43.18,17.14 | C1.2 U1.3 17.14,64.77 17.78,64.14 17.78,55.88 | 17.78,7.62 17.78,15.24 | 17.78,15.24 17.78,17.78 | 17.78,17.78 17.78,20.32 | 17.78,20.32 17.78,22.86 | 17.78,22.86 17.78,30.48 | 17.78,30.48 17.78,33.02 | 17.78,33.02 17.78,40.64 | 17.78,40.64 17.78,43.18 | 17.78,43.18 17.78,48.26 | 17.78,48.26 17.78,55.88 | R17.2 17.78,7.62 | R1.2 17.78,15.24 | R12.2 17.78,17.78 | R5.2 17.78,55.88 | 17.78,48.26 R19.2 R10.2 | R11.2 17.78,43.18 | R3.2 17.78,40.64 | R18.2 17.78,33.02 | R7.2 17.78,30.48 | R9.2 17.78,20.32 | R20.2 17.78,22.86
+24V
  Top 0.508: J11.2 D1.2
+24VP
  Top 0.508: D1.1 71.12,4.45 70.78,4.79 J11.4 73.24,10.16 78.74,10.16 79.38,10.79 79.38,22.23 80.01,22.86 RLA1.1
GND  (via drill 0.35)
  Top 0.508: U2.12 v47.31,64.77 | U1.12 v22.23,64.77 | U2.12 U2.11 U2.10 | U2.12 U2.13 | U3.12 v73.03,64.77 | U3.12 U3.11 U3.10 | U3.12 U3.13 | CR1.1 10.46,131.27 v10.48,131.29 | CR2.1 10.46,110.95 v10.48,110.97 | CR3.1 10.46,90.63 v10.48,90.65 | CR4.1 10.46,71.58 v10.48,71.6 | CR5.1 35.87,110.95 v35.88,110.97 | CR6.1 35.87,90.63 v35.88,90.65 | CR7.1 35.87,71.58 v35.88,71.6 | CR10.1 61.27,71.58 v61.28,71.6 | CR9.1 61.27,90.63 v61.28,90.65 | CR8.1 61.27,110.95 v61.28,110.97
  pour Bottom: 0,0 88.9,0 88.9,152.4 0,152.4
REF1
  Top 0.254: R2.2 R13.2 R1.1 24.13,15.24 24.77,15.88 24.77,39.37 25.4,40.01 25.4,43.81 26.04,44.45 26.04,62.87 25.4,63.5 U1.11
REF2
  Top 0.254: U1.9 24.13,60.96 24.77,60.33 24.77,45.72 24.13,45.09 24.13,41.27 23.5,40.64 R3.1 R4.2 R14.2
REF3
  Top 0.254: U1.7 13.34,59.69 12.7,59.05 R5.1 R6.2 R15.2
REF4  (via drill 0.35)
  Top 0.254: R16.2 R8.2 R7.1 21.59,31.75 v19.05,31.75 | U1.5 11.43,62.23 10.79,61.59 10.79,43.18 11.43,42.55 11.43,32.38 12.06,31.75 v16.51,31.75
  Bottom 0.254: v19.05,31.75 v16.51,31.75
REF5
  Top 0.254: U2.9 49.53,60.96 50.16,60.33 50.16,45.09 R21.1 R22.2 R30.2
REF6
  Top 0.254: R31.2 R24.2 R23.1 38.1,59.05 38.73,59.69 U2.7
REF7
  Top 0.254: R32.2 R25.1 R26.2 38.1,31.11 36.2,33.02 36.2,61.59 36.83,62.23 U2.5
REF8
  Top 0.254: U3.9 74.93,60.96 75.56,60.33 75.56,45.09 R36.1 R37.2 R45.2
REF9
  Top 0.254: U3.7 64.14,59.69 63.5,59.05 R38.1 R39.2 R46.2
REF10
  Top 0.254: R47.2 R40.1 R41.2 63.5,31.11 61.59,33.02 61.59,61.59 62.23,62.23 U3.5
THER1-IN  (via drill 0.35)
  Top 0.254: U1.10 24.77,62.23 25.4,61.59 25.4,45.09 24.77,44.45 24.77,40.64 24.13,40.01 24.13,21.59 R9.1 | J1.4 27.3,139.7 28.57,138.43 28.57,45.72 27.3,44.45 27.3,43.18 26.67,42.55 26.67,38.73 26.04,38.1 v26.04,20.32
  Top 0.508: CR1.3 12.39,139.4 12.7,139.7 J1.4
  Bottom 0.254: v26.04,20.32 R9.1
THER1-SIG  (via drill 0.35)
  Top 0.254: v16.51,12.7 R13.1 12.06,12.7 11.43,12.06 11.43,5.71 12.06,5.08 31.75,5.08 32.28,5.61 J11.15 | v19.05,12.7 19.05,8.26 19.68,7.62 R17.1 23.5,7.62 24.13,8.26 24.13,13.97 25.4,15.24 25.4,38.73 26.04,39.37 26.04,43.18 26.67,43.81 26.67,65.41 26.04,66.04 U1.13
  Bottom 0.254: v16.51,12.7 v19.05,12.7
THER2-IN  (via drill 0.35)
  Top 0.254: J2.4 16.51,119.38 26.67,119.38 27.94,118.11 27.94,46.35 v27.3,45.72 | R10.1 23.5,45.72 24.13,46.35 24.13,59.05 23.5,59.69 U1.8
  Top 0.508: CR2.3 12.39,119.08 12.7,119.38 16.51,119.38
  Bottom 0.254: v27.3,45.72 R10.1
THER2-SIG  (via drill 0.35)
  Top 0.254: R14.1 R18.1 | U1.14 17.78,67.31 17.14,67.94 9.53,67.94 8.89,67.31 8.89,41.27 9.53,40.64 v9.53,33.02 | J11.12 42.78,4.68 41.91,3.81 10.79,3.81 10.16,4.45 10.16,16.51 9.53,17.14 9.53,29.21 8.26,30.48 v8.26,33.02
  Bottom 0.254: R18.1 v9.53,33.02 v8.26,33.02
THER3-IN  (via drill 0.35)
  Top 0.254: R11.1 12.06,43.18 11.43,43.81 11.43,60.33 12.06,60.96 U1.6 | J3.4 15.88,99.06 8.26,99.06 7.62,98.42 v7.62,43.18
  Top 0.508: CR3.3 12.39,95.58 15.88,99.06
  Bottom 0.254: v7.62,43.18 R11.1
THER3-SIG  (via drill 0.35)
  Top 0.254: R19.1 R15.1 | U1.1 16.51,67.31 17.14,66.67 26.67,66.67 27.3,66.04 v27.3,48.26 | v29.21,15.88 29.84,15.24 45.72,15.24 46.28,14.68 J11.11 | v29.21,48.26 v29.21,18.41
  Bottom 0.254: R19.1 v27.3,48.26 v29.21,48.26 | v29.21,18.41 v29.21,15.88
THER4-IN  (via drill 0.35)
  Top 0.254: J4.4 8.89,78.74 8.26,78.11 8.26,40.64 8.89,40.01 8.89,31.11 10.16,29.84 v10.16,17.78 | U1.4 10.79,63.5 10.16,62.87 10.16,42.55 10.79,41.91 10.79,31.75 11.43,31.11 11.43,18.41 12.06,17.78 R12.1
  Top 0.508: CR4.3 12.39,75.11 J4.4
  Bottom 0.254: v10.16,17.78 R12.1
THER4-SIG  (via drill 0.35)
  Top 0.254: R16.1 R20.1 | U1.2 10.16,66.04 9.53,65.41 9.53,41.91 10.16,41.27 10.16,31.11 10.79,30.48 v10.79,25.4 10.79,5.08 11.43,4.45 34.92,4.45 35.78,5.3 J11.14
  Bottom 0.254: v10.79,25.4 R16.1
THER5-IN  (via drill 0.35)
  Top 0.254: U2.8 48.9,59.69 49.53,59.05 49.53,46.35 48.9,45.72 R27.1 | v50.8,45.72 50.8,49.53 51.44,50.16 51.44,118.75 50.8,119.38 J5.4
  Top 0.508: CR5.3 37.8,119.08 38.1,119.38 J5.4
  Bottom 0.254: R27.1 v50.8,45.72
THER5-SIG  (via drill 0.35)
  Top 0.254: U2.14 43.81,67.31 43.18,67.94 34.92,67.94 34.29,67.31 v34.29,38.1 | R33.1 R30.1 | v32.38,38.1 32.38,36.2 33.02,35.56 33.02,31.11 34.92,29.21 v34.92,18.41 | v34.92,15.88 49.53,15.88 49.78,15.62 J11.10
  Bottom 0.254: R30.1 v34.29,38.1 v32.38,38.1 | v34.92,18.41 v34.92,15.88
THER6-IN  (via drill 0.35)
  Top 0.254: U2.6 37.47,60.96 36.83,60.33 36.83,33.66 37.47,33.02 R28.1 | J6.4 41.27,99.06 33.66,99.06 33.02,98.42 33.02,36.83 33.66,36.2 v33.66,33.02
  Top 0.508: CR6.3 37.8,95.58 41.27,99.06
  Bottom 0.254: v33.66,33.02 R28.1
THER6-SIG  (via drill 0.35)
  Top 0.254: R34.1 R31.1 | v50.8,50.8 50.8,66.04 50.16,66.67 43.18,66.67 42.55,67.31 U2.1 | v52.07,50.8 55.88,50.8 56.52,50.16 v56.52,18.41 | J11.8 56.52,7.96 v56.52,15.88
  Bottom 0.254: R31.1 v50.8,50.8 v52.07,50.8 | v56.52,18.41 v56.52,15.88
THER7-IN
  Top 0.254: U2.4 36.2,63.5 35.56,62.87 35.56,32.38 36.83,31.11 36.83,21.59 36.51,21.27 | 36.51,21.27 37.47,20.32 R29.1 | J7.4 34.29,78.74 33.66,78.11 33.66,37.47 34.29,36.83 34.29,31.11 35.56,29.84 35.56,22.23 36.51,21.27
  Top 0.508: CR7.3 37.8,75.11 J7.4
THER7-SIG  (via drill 0.35)
  Top 0.254: U2.2 35.56,66.04 34.92,65.41 34.92,31.75 36.2,30.48 v36.2,22.86 | R35.1 v41.91,22.86 | v53.34,18.41 53.34,24.77 52.7,25.4 R32.1 45.09,25.4 44.45,24.77 v44.45,22.86 | v53.34,15.88 53.34,12.76 J11.9
  Bottom 0.254: v36.2,22.86 R35.1 | v53.34,18.41 v53.34,15.88 | v41.91,22.86 v44.45,22.86
THER8-IN  (via drill 0.35)
  Top 0.254: U3.8 74.3,59.69 74.93,59.05 74.93,46.35 74.3,45.72 R42.1 | J8.4 67.31,119.38 76.2,119.38 76.83,118.75 76.83,50.16 76.2,49.53 v76.2,45.72
  Top 0.508: CR8.3 63.2,119.08 63.5,119.38 67.31,119.38
  Bottom 0.254: v76.2,45.72 R42.1
THER8-SIG  (via drill 0.35)
  Top 0.254: U3.14 69.22,67.31 68.58,67.94 60.33,67.94 59.69,67.31 v59.69,38.1 | R48.1 R45.1 | v57.78,38.1 57.78,36.2 58.42,35.56 58.42,31.11 60.33,29.21 v60.33,18.41 | v60.33,15.88 60.33,12.74 J11.7
  Bottom 0.254: R45.1 v59.69,38.1 v57.78,38.1 | v60.33,18.41 v60.33,15.88
THER9-IN  (via drill 0.35)
  Top 0.254: U3.6 62.87,60.96 62.23,60.33 62.23,33.66 62.87,33.02 R43.1 | v59.05,33.02 59.05,36.2 58.42,36.83 58.42,98.42 59.05,99.06 J9.4
  Top 0.508: CR9.3 63.2,95.42 J9.4
  Bottom 0.254: v59.05,33.02 R43.1
THER9-SIG  (via drill 0.35)
  Top 0.254: R49.1 R46.1 | U3.1 67.94,67.31 68.58,66.67 75.56,66.67 76.2,66.04 v76.2,50.8 | J11.6 63.78,2.26 64.14,1.91 84.45,1.91 85.09,2.54 85.09,50.16 84.45,50.8 v77.47,50.8
  Bottom 0.254: R46.1 v76.2,50.8 v77.47,50.8
THER10-IN
  Top 0.254: U3.4 61.59,63.5 60.96,62.87 60.96,32.38 62.23,31.11 62.23,21.59 61.91,21.27 | J10.4 59.69,78.74 59.05,78.11 59.05,37.47 59.69,36.83 59.69,31.11 60.96,29.84 60.96,22.23 61.91,21.27 | R44.1 62.87,20.32 61.91,21.27
  Top 0.508: CR10.3 63.2,75.11 J10.4
THER10-SIG  (via drill 0.35)
  Top 0.254: U3.2 60.96,66.04 60.33,65.41 60.33,31.75 61.59,30.48 v61.59,22.86 | R50.1 v67.31,22.86 | v69.85,25.4 R47.1 74.93,25.4 75.56,24.77 75.56,15.88 74.93,15.24 67.94,15.24 67.28,14.57 J11.5
  Bottom 0.254: v61.59,22.86 R50.1 | v67.31,22.86 v69.85,25.4

### Text on the board
tPlace: VLMi LN2 Thermistor Sensors | Omit R17, R18, R19, R20, R33, R34, R35, / R48, R49, and R50 for dry contact inputs | Use Advantech Adam 6251-B / Digital Input to Ethernet | 2023-06-30 | o | o | o | o | o | o | +5V | o | o | o | +24V | o
bPlace: T1 | T4 | COM | T2 | T3 | T5 | T7 | T6 | T8 | TH9 | T10 | 24VP | GND | 24V | GND